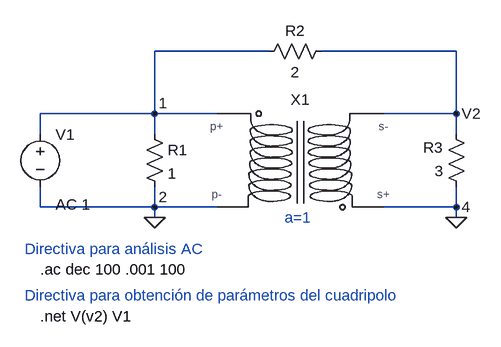
[diagram p0: schematic simulacion circuital cuadripolo trafo.asc]
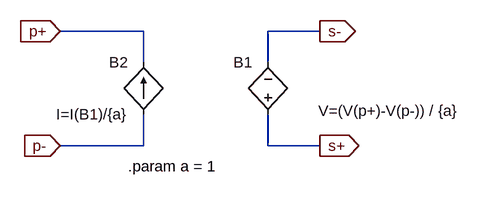
[diagram p1: sub-circuit trafo_ideal.asc]
simulacion circuital cuadripolo trafo.asc, the LTspice schematic file:
Version 4
SHEET 1 880 680
WIRE 112 0 -64 0
WIRE 400 0 192 0
WIRE -64 96 -64 0
WIRE -64 96 -240 96
WIRE 32 96 -64 96
WIRE 400 96 400 0
WIRE 400 96 288 96
WIRE -240 128 -240 96
WIRE -64 128 -64 96
WIRE 400 128 400 96
WIRE -240 240 -240 208
WIRE -64 240 -64 208
WIRE -64 240 -240 240
WIRE 32 240 -64 240
WIRE 400 240 400 208
WIRE 400 240 288 240
WIRE -64 256 -64 240
WIRE 400 256 400 240
FLAG -64 256 0
FLAG 400 256 0
FLAG -64 96 1
FLAG -64 240 2
FLAG 400 240 4
FLAG 400 96 V2
SYMBOL res -80 112 R0
SYMATTR InstName R1
SYMATTR Value 1
SYMBOL res 208 -16 R90
WINDOW 0 0 56 VBottom 2
WINDOW 3 32 56 VTop 2
SYMATTR InstName R2
SYMATTR Value 2
SYMBOL res 416 224 R180
WINDOW 0 36 76 Left 2
WINDOW 3 36 40 Left 2
SYMATTR InstName R3
SYMATTR Value 3
SYMBOL voltage -240 112 R0
WINDOW 123 24 124 Left 2
WINDOW 39 0 0 Left 0
SYMATTR InstName V1
SYMATTR Value ""
SYMATTR Value2 AC 1
SYMBOL trafo_ideal 144 160 R0
WINDOW 0 16 -70 Bottom 2
SYMATTR InstName X1
TEXT -240 336 Left 2 !.ac dec 100 .001 100
TEXT -240 408 Left 2 !.net V(v2) V1
TEXT -264 304 Left 2 ;Directiva para análisis AC
TEXT -264 376 Left 2 ;Directiva para obtención de parámetros del cuadripolo
TEXT 136 256 Left 2 ;a=1

trafo_ideal.asc, the sub-circuit schematic file:
Version 4
SHEET 1 880 680
WIRE -16 80 -144 80
WIRE 256 80 176 80
WIRE -16 128 -16 80
WIRE 176 128 176 80
WIRE -16 256 -16 208
WIRE -16 256 -144 256
WIRE 176 256 176 208
WIRE 256 256 176 256
FLAG 256 80 s-
IOPIN 256 80 Out
FLAG 256 256 s+
IOPIN 256 256 Out
FLAG -144 80 p+
IOPIN -144 80 In
FLAG -144 256 p-
IOPIN -144 256 In
SYMBOL bi -16 208 R180
WINDOW 0 24 80 Left 2
WINDOW 3 24 0 Left 2
SYMATTR InstName B2
SYMATTR Value I=I(B1)/{a}
SYMBOL bv 176 224 R180
WINDOW 3 -296 22 Left 2
WINDOW 0 24 96 Left 2
SYMATTR Value V=(V(p+)-V(p-)) / {a}
SYMATTR InstName B1
TEXT -40 288 Left 2 !.param a = 1

The netlist it stands for:
* simulacion circuital cuadripolo trafo.asc
R1 1 0 1
R2 V2 1 2
R3 0 V2 3
V1 1 0 AC 1
XX1 0 V2 1 0 trafo_ideal

* block symbol definitions
.subckt trafo_ideal s+ s- p+ p-
B2 p- p+ I=I(B1)/{a}
B1 s+ s- V=(V(p+)-V(p-)) / {a}
.param a = 1
.ends trafo_ideal

.ac dec 100 .001 100
.net V(v2) V1
* Directiva para análisis AC
* Directiva para obtención de parámetros del cuadripolo
* a=1
.backanno
.end